# EAGLE schematic LFO (EAGLE 7.5.0)
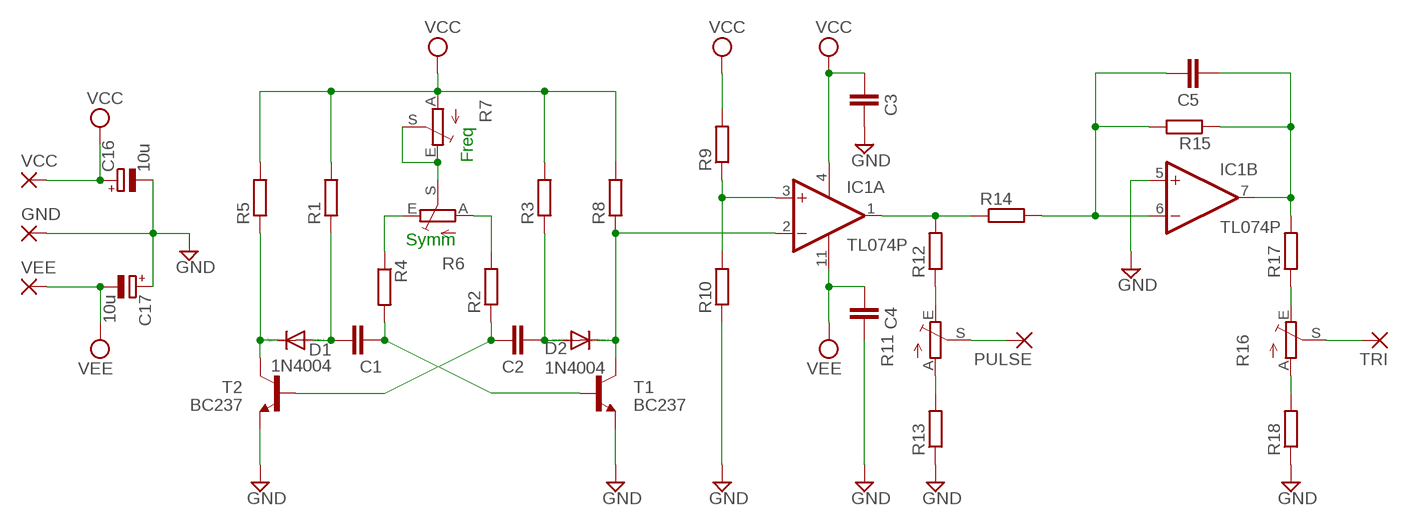
[diagram p0: schematic, sheet 1]

## Parts
C1  C-EU050-045X075  [C050-045X075]
C2  C-EU050-045X075  [C050-045X075]
C3  C-EU050-045X075  [C050-045X075]
C4  C-EU050-045X075  [C050-045X075]
C5  C-EU050-045X075  [C050-045X075]
C16  10u  CPOL-EUE2.5-7  [E2,5-7]
C17  10u  CPOL-EUE2.5-7  [E2,5-7]
D1  1N4004  [DO41-10]
D2  1N4004  [DO41-10]
GND  3,17/1,1  [3,17/1,1]
IC1  TL074P  [DIL14]
PULSE  3,17/1,1  [3,17/1,1]
R1  R-EU_0207/10  [0207/10]
R2  R-EU_0207/10  [0207/10]
R3  R-EU_0207/10  [0207/10]
R4  R-EU_0207/10  [0207/10]
R5  R-EU_0207/10  [0207/10]
R6  TRIM_EU-S75P  [S75P]
R7  TRIM_EU-S75P  [S75P]
R8  R-EU_0207/10  [0207/10]
R9  R-EU_0207/10  [0207/10]
R10  R-EU_0207/10  [0207/10]
R11  TRIM_EU-S75P  [S75P]
R12  R-EU_0207/10  [0207/10]
R13  R-EU_0207/10  [0207/10]
R14  R-EU_0207/10  [0207/10]
R15  R-EU_0207/10  [0207/10]
R16  TRIM_EU-S75P  [S75P]
R17  R-EU_0207/10  [0207/10]
R18  R-EU_0207/10  [0207/10]
T1  BC237  [TO92]
T2  BC237  [TO92]
TRI  3,17/1,1  [3,17/1,1]
VCC  3,17/1,1  [3,17/1,1]
VEE  3,17/1,1  [3,17/1,1]

## Nets
GND: C3.2 C4.2 C16.- C17.+ GND.1(P) IC1.5(B:+IN) R10.1 R13.1 R18.1 T1.1(E) T2.1(E)
N$1: C2.2 R2.1 T2.2(B)
N$2: C2.1 D2.A R3.1
N$3: D1.C R5.1 T2.3(C)
N$4: C1.2 D1.A R1.1
N$5: C1.1 R4.2 T1.2(B)
N$6: D2.C IC1.2(A:-IN) R8.1 T1.3(C)
N$7: R4.1 R6.E
N$8: R2.2 R6.A
N$9: R6.S R7.E R7.S
N$10: PULSE.1(P) R11.S
N$11: IC1.3(A:+IN) R9.1 R10.2
N$12: R11.A R13.2
N$13: IC1.1(A:OUT) R12.2 R14.1
N$14: R11.E R12.1
N$16: C5.1 IC1.7(B:OUT) R15.1 R17.2
N$17: C5.2 IC1.6(B:-IN) R14.2 R15.2
N$19: R16.S TRI.1(P)
N$20: R16.A R18.2
N$21: R16.E R17.1
VCC: C3.1 C16.+ IC1.4(P:V+) R1.2 R3.2 R5.2 R7.A R8.2 R9.2 VCC.1(P)
VEE [Power]: C4.1 C17.- IC1.11(P:V-) VEE.1(P)
Unconnected: IC1.8(C:OUT) IC1.9(C:-IN) IC1.10(C:+IN) IC1.12(D:+IN) IC1.13(D:-IN) IC1.14(D:OUT)

## Notes on the sheet
- Freq
- Symm

## Library data of the parts
C1-C5 = rcl:C-EU: CAPACITOR, European symbol
C16 C17 = rcl:CPOL-EU: POLARIZED CAPACITOR, European symbol
D1 D2 = diode:1N4004: DIODE general purpose rectifier, 1 A
GND PULSE TRI VCC VEE = wirepad:3,17/1,1: THROUGH-HOLE PAD
IC1 = linear:TL074: OP AMP
R1-R5 R8-R10 R12-R15 R17 R18 = rcl:R-EU_: RESISTOR, European symbol
R6 R7 R11 R16 = pot:TRIM_EU-: POTENTIOMETER
T1 T2 = transistor:BC237: NPN TRANSISTOR

## Net classes
1 Power: width 1.016 mm, clearance 0.508 mm